# Altium schematic sheet Error Calculation Schem.SchDoc
size A4
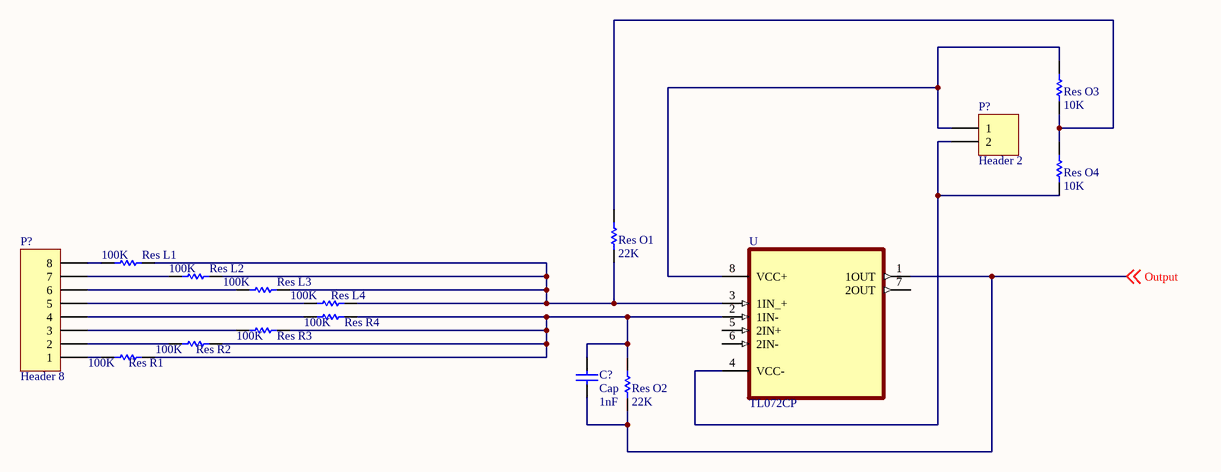
[diagram p0: Error Calculation Schem.SchDoc]

## Parts
(Parts that share a designator on the sheet are numbered #1, #2 ... from top to bottom, then left to right.)
?#1  Res O3  value 10K  [AXIAL-0.3]
?#2  Res O4  value 10K  [AXIAL-0.3]
?#3  Res L1  value 100K  [AXIAL-0.3]
?#4  Res O1  value 22K  [AXIAL-0.3]
?#5  Res L2  value 100K  [AXIAL-0.3]
?#6  Res L3  value 100K  [AXIAL-0.3]
?#7  Res L4  value 100K  [AXIAL-0.3]
?#8  Res R4  value 100K  [AXIAL-0.3]
?#9  Res R3  value 100K  [AXIAL-0.3]
?#10  Res R2  value 100K  [AXIAL-0.3]
?#11  Res R1  value 100K  [AXIAL-0.3]
?#12  Res O2  value 22K  [AXIAL-0.3]
C?  Cap  value 1nF  [RAD-0.3]
P?#1  Header 2  [HDR1X2]
P?#2  Header 8  [HDR1X8]
U  TL072CP  [DIP254P762X508-8]

## Nets
Output: ?#12.1 C?.1 U.1(1OUT) ; off-sheet Output
Net?#1_1: ?#1.1 ?#2.2 ?#4.2
Net?#1_2: ?#1.2 P?#1.1 U.8(VCC+)
Net?#2_1: ?#2.1 P?#1.2 U.4(VCC-)
Net?#3_1: ?#3.1 P?#2.8
Net?#3_2: ?#3.2 ?#4.1 ?#5.2 ?#6.2 ?#7.2 U.3(1IN_+)
Net?#5_1: ?#5.1 P?#2.7
Net?#6_1: ?#6.1 P?#2.6
Net?#7_1: ?#7.1 P?#2.5
Net?#8_1: ?#8.1 P?#2.4
Net?#8_2: ?#8.2 ?#9.2 ?#10.2 ?#11.2 ?#12.2 C?.2 U.2(1IN-)
Net?#9_1: ?#9.1 P?#2.3
Net?#10_1: ?#10.1 P?#2.2
Net?#11_1: ?#11.1 P?#2.1

Not connected (* = marked no-connect by the designer): U 5(2IN+) 6(2IN-) 7(2OUT)

## Library data of the parts
?#1-?#12 = Res1: Resistor; Published: 8-Jun-2000; LatestRevisionDate: 17-Jul-2002; LatestRevisionNote: Re-released for DXP Platform.; PackageReference: AXIAL-0.3; Publisher: Altium Limited; PackageDescription: Axial Device, Thru-Hole; 2 Leads; 0.3 in Pin Spacing
C? = Cap: Capacitor; Published: 8-Jun-2000; LatestRevisionDate: 17-Jul-2002; LatestRevisionNote: Re-released for DXP Platform.; PackageReference: RAD-0.3; Publisher: Altium Limited; PackageDescription: Radial Cap, Thru-Hole; 2 Leads; 0.3 in Pin Spacing
P?#1 = Header 2: Header, 2-Pin; LatestRevisionDate: 17-Jul-2002; LatestRevisionNote: Re-released for DXP Platform.; Publisher: Altium Limited
P?#2 = Header 8: Header, 8-Pin; LatestRevisionDate: 17-Jul-2002; LatestRevisionNote: Re-released for DXP Platform.; Publisher: Altium Limited
U = TL072CP: J-FET Amplifier 2 Circuit 8-PDIP; MF: Texas Instruments; Availability: Unavailable; Package: PDIP-8 ON Semiconductor; SnapEDA_Link: https://www.snapeda.com/parts/TL072CP/Texas%20Instruments/view-part/2181721/?ref=snap; MP: TL072CP; Price: None; Value: *